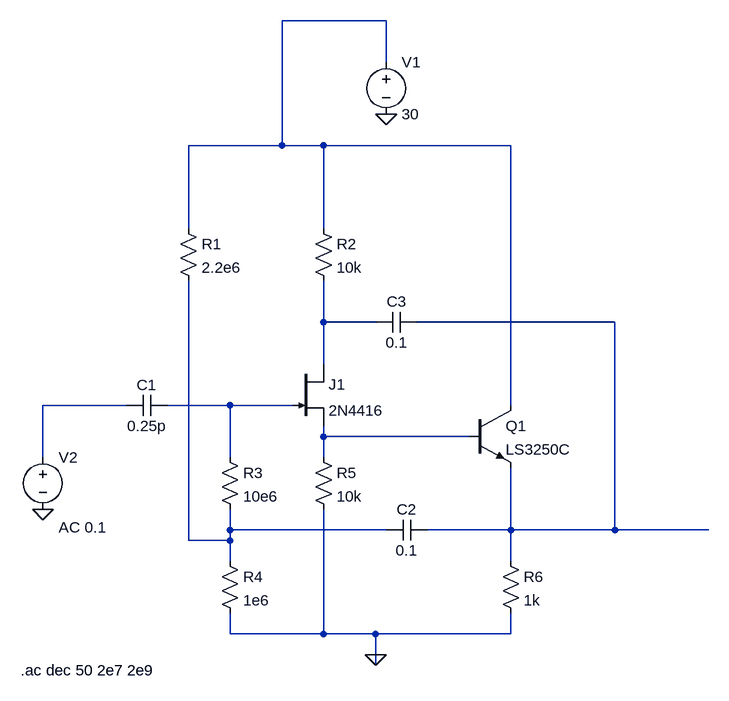
[diagram p0: schematic Draft9.asc]
Draft9.asc, the LTspice schematic file:
Version 4
SHEET 1 880 680
WIRE 224 -416 64 -416
WIRE 224 -352 224 -416
WIRE 64 -224 64 -416
WIRE 64 -224 -80 -224
WIRE 128 -224 64 -224
WIRE 416 -224 128 -224
WIRE -80 -96 -80 -224
WIRE 128 -96 128 -224
WIRE 128 48 128 -16
WIRE 208 48 128 48
WIRE 576 48 272 48
WIRE 128 112 128 48
WIRE -176 176 -304 176
WIRE -16 176 -112 176
WIRE 80 176 -16 176
WIRE 416 176 416 -224
WIRE 128 224 128 208
WIRE 352 224 128 224
WIRE -304 256 -304 176
WIRE -16 256 -16 176
WIRE 128 256 128 224
WIRE -16 368 -16 336
WIRE 224 368 -16 368
WIRE 416 368 416 272
WIRE 416 368 288 368
WIRE 576 368 576 48
WIRE 576 368 416 368
WIRE 720 368 576 368
WIRE -80 384 -80 -16
WIRE -16 384 -16 368
WIRE -16 384 -80 384
WIRE -16 416 -16 384
WIRE 416 416 416 368
WIRE -16 528 -16 496
WIRE 128 528 128 336
WIRE 128 528 -16 528
WIRE 208 528 128 528
WIRE 416 528 416 496
WIRE 416 528 208 528
WIRE 208 560 208 528
WIRE 208 576 208 560
FLAG -304 336 0
FLAG 224 -272 0
FLAG 208 560 0
SYMBOL njf 80 112 R0
SYMATTR InstName J1
SYMATTR Value 2N4416
SYMBOL res -96 -112 R0
SYMATTR InstName R1
SYMATTR Value 2.2e6
SYMBOL res 112 -112 R0
SYMATTR InstName R2
SYMATTR Value 10k
SYMBOL res -32 240 R0
SYMATTR InstName R3
SYMATTR Value 10e6
SYMBOL res -32 400 R0
SYMATTR InstName R4
SYMATTR Value 1e6
SYMBOL res 112 240 R0
SYMATTR InstName R5
SYMATTR Value 10k
SYMBOL res 400 400 R0
SYMATTR InstName R6
SYMATTR Value 1k
SYMBOL cap -112 160 R90
WINDOW 0 0 32 VBottom 2
WINDOW 3 32 32 VTop 2
SYMATTR InstName C1
SYMATTR Value 0.25p
SYMBOL cap 288 352 R90
WINDOW 0 0 32 VBottom 2
WINDOW 3 32 32 VTop 2
SYMATTR InstName C2
SYMATTR Value 0.1
SYMBOL cap 272 32 R90
WINDOW 0 0 32 VBottom 2
WINDOW 3 32 32 VTop 2
SYMATTR InstName C3
SYMATTR Value 0.1
SYMBOL npn 352 176 R0
SYMATTR InstName Q1
SYMATTR Value LS3250C
SYMBOL voltage 224 -368 R0
WINDOW 123 0 0 Left 0
WINDOW 39 0 0 Left 0
SYMATTR InstName V1
SYMATTR Value 30
SYMBOL voltage -304 240 R0
WINDOW 123 24 124 Left 2
WINDOW 39 0 0 Left 0
SYMATTR InstName V2
SYMATTR Value ""
SYMATTR Value2 AC 0.1
TEXT -338 584 Left 2 !.ac dec 50 2e7 2e9

The netlist it stands for:
* Draft9.asc
J1 N002 N005 N006 2N4416
R1 N001 N007 2.2e6
R2 N001 N002 10k
R3 N005 N007 10e6
R4 N007 0 1e6
R5 N006 0 10k
R6 N003 0 1k
C1 N005 N004 0.25p
C2 N003 N007 0.1
C3 N003 N002 0.1
Q1 N001 N006 N003 0 LS3250C
V1 N001 0 30
V2 N004 0 AC 0.1
.model NPN NPN
.model PNP PNP
.lib standard.bjt
.model NJF NJF
.model PJF PJF
.lib standard.jft
.ac dec 50 2e7 2e9
.backanno
.end